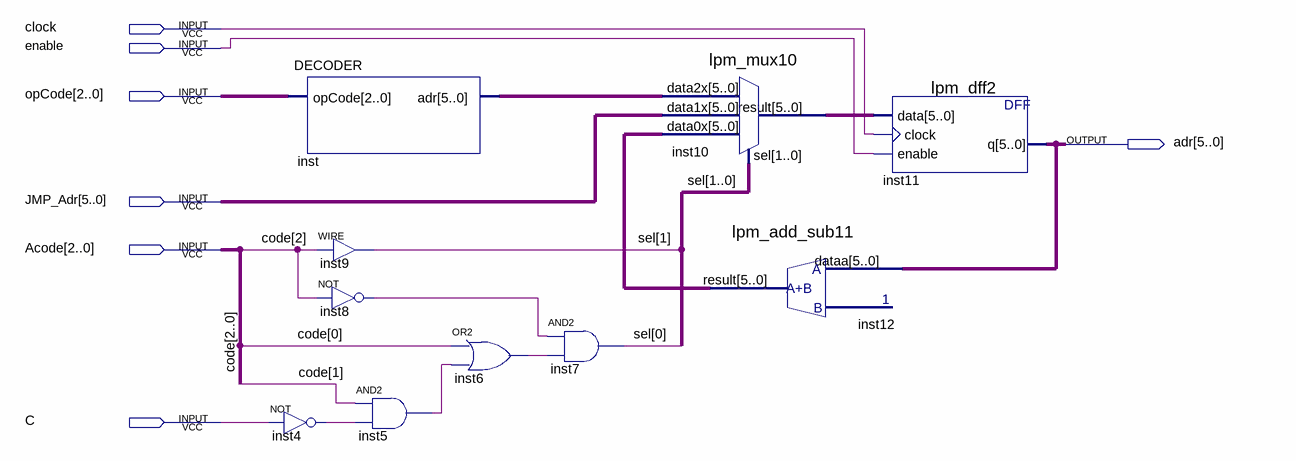
[diagram p0: schematic sheet]
// Quartus schematic ADR_FORM_UU.bdf as structural Verilog: 10 symbols, 7 pins
module ADR_FORM_UU (
  input  clock,
  input  enable,
  input  [2:0] opCode,
  input  [5:0] JMP_Adr,
  input  [2:0] Acode,
  input  C,
  output [5:0] adr
);

  wire inst4_out, inst5_out, inst6_out, inst8_out;
  wire [1:0] sel;
  wire [5:0] inst10_result, inst12_result, inst_adr;

  DECODER inst (.opCode(opCode), .adr(inst_adr));
  assign sel[1] = Acode[2];  // WIRE inst9
  not inst8 (inst8_out, Acode[2]);
  not inst4 (inst4_out, C);
  and inst5 (inst5_out, Acode[1], inst4_out);
  or inst6 (inst6_out, Acode[0], inst5_out);
  and inst7 (sel[0], inst8_out, inst6_out);
  lpm_mux10 inst10 (.data2x(inst_adr), .data1x(JMP_Adr), .data0x(inst12_result), .sel(sel), .result(inst10_result));
  lpm_add_sub11 inst12 (.dataa(adr), .result(inst12_result));
  lpm_dff2 inst11 (.data(inst10_result), .clock(clock), .enable(enable), .q(adr));

  // Other names for the same wires on the sheet: code[2:0] = Acode
endmodule
